# EAGLE design IG01 (EAGLE 6.3)
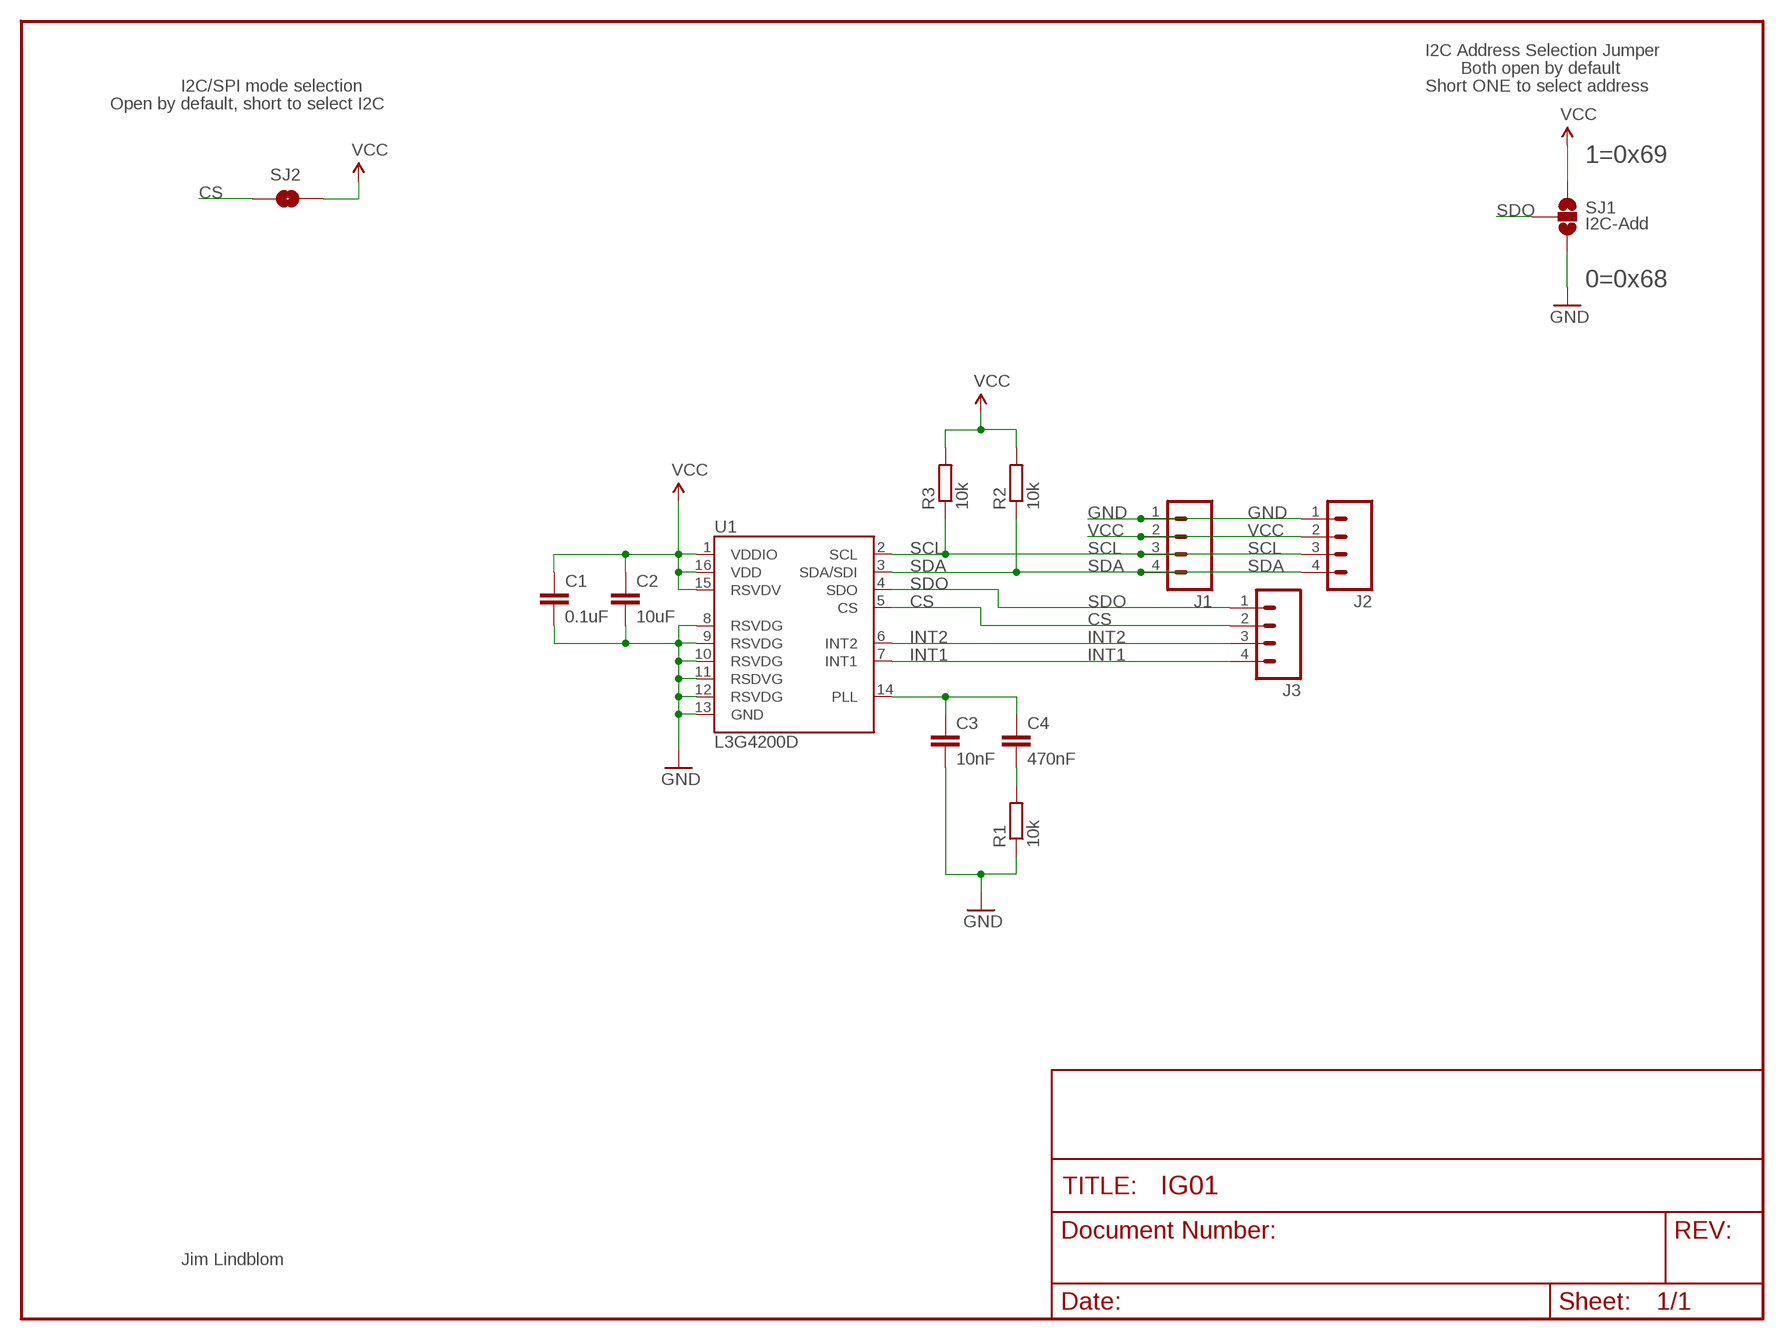
[diagram p0: schematic, sheet 1]

## Parts
C1  0.1uF  C-EUC0805  [C0805]
C2  10uF  C-EUC1206  [C1206]
C3  10nF  C-EUC0805  [C0805]
C4  470nF  C-EUC0805  [C0805]
J1  M04PTH  [1X04]
J2  M04PTH  [1X04]
J3  M04PTH  [1X04]
R1  10k  R-EU_M0805  [M0805]
R2  10k  R-EU_M0805  [M0805]
R3  10k  R-EU_M0805  [M0805]
SJ1  I2C-Add  SOLDERJUMPER_2WAYS  [SJ_3]
SJ2  I2C-Mode  SOLDERJUMPERNO  [SJ_2S-NO]
U1  L3G4200D  [LGA16-4X4]

## Nets
CS: J3.2 SJ2.1 U1.5(CS)
GND: C1.2 C2.2 C3.2 J1.1 J2.1 R1.1 SJ1.3 U1.8(RSVDG) U1.9(RSVDG) U1.10(RSVDG) U1.11(RSDVG) U1.12(RSVDG) U1.13(GND)
INT1: J3.4 U1.7(INT1)
INT2: J3.3 U1.6(INT2)
PLL: C3.1 C4.1 U1.14(PLL)
PLL-2: C4.2 R1.2
SCL: J1.3 J2.3 R3.1 U1.2(SCL)
SDA: J1.4 J2.4 R2.1 U1.3(SDA/SDI)
SDO: J3.1 SJ1.2 U1.4(SDO)
VCC: C1.1 C2.1 J1.2 J2.2 R2.2 R3.2 SJ1.1 SJ2.2 U1.1(VDDIO) U1.15(RSVDV) U1.16(VDD)

## Notes on the sheet
- I2C Address Selection Jumper
- Both open by default
- I2C/SPI mode selection | Short ONE to select address
- Open by default, short to select I2C
- 1=0x69
- 0=0x68
- Jim Lindblom

## Library data of the parts
C1-C4 = rcl:C-EU: CAPACITOR, European symbol
J1-J3 = SparkFun:M04: Header 4 Standard 4-pin 0.1" header. Use with straight break away headers (SKU : PRT-00116), right angle break away headers (PRT-00553), swiss pins (PRT-00743), machine pins (PRT-00117), and female headers (PRT-00115). Molex polarized connector foot print use with SKU : PRT-08231 with associated crimp pins and housings. 1MM SMD Version SKU: PRT-10208
R1-R3 = rcl:R-EU_: RESISTOR, European symbol
SJ1 = SparkFun:SOLDERJUMPER_2WAY: Solder Jumper 2 way solder jumper
SJ2 = SparkFun:SOLDERJUMPER: Solder Jumper Standard SMD solder jumper. Used to automate production. Two varients : Normally Open and Normally Closed are the same, but have different paste layers. NC will have a large amount of paste and should jumper during reflow.
U1 = SparkFun:L3G4200D: L3G4200D Three-axis, digital output gyroscope The L3G4200D is a low-power three-axis angular rate sensor, has a full scale of ±250/±500/±2000 dps and is capable of measuring rates with a user-selectable bandwidth. It includes a sensing element and an IC interface capable of providing the measured angular rate to the external world through a digital interface (I2C/SPI). Package: 4x4x1.1 LGA-16 (LGA16-4x4.PAC)

## Board
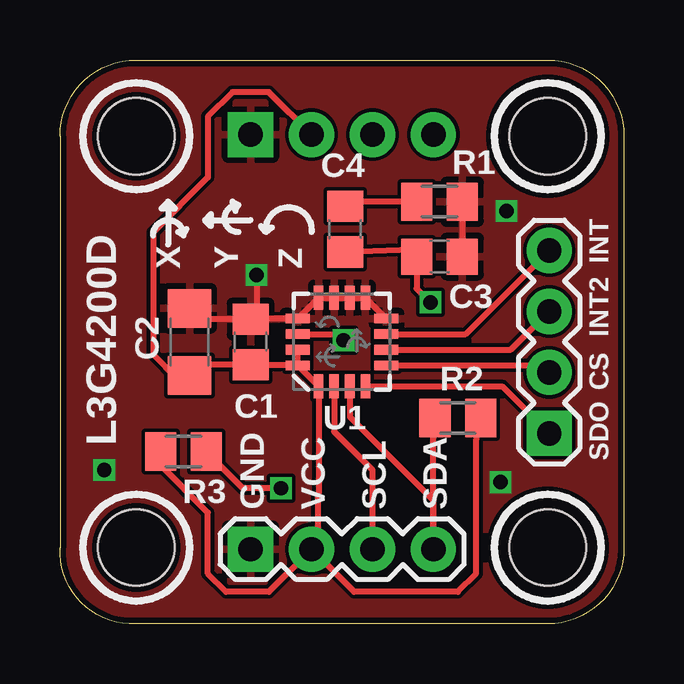
[diagram p1: board, top side]
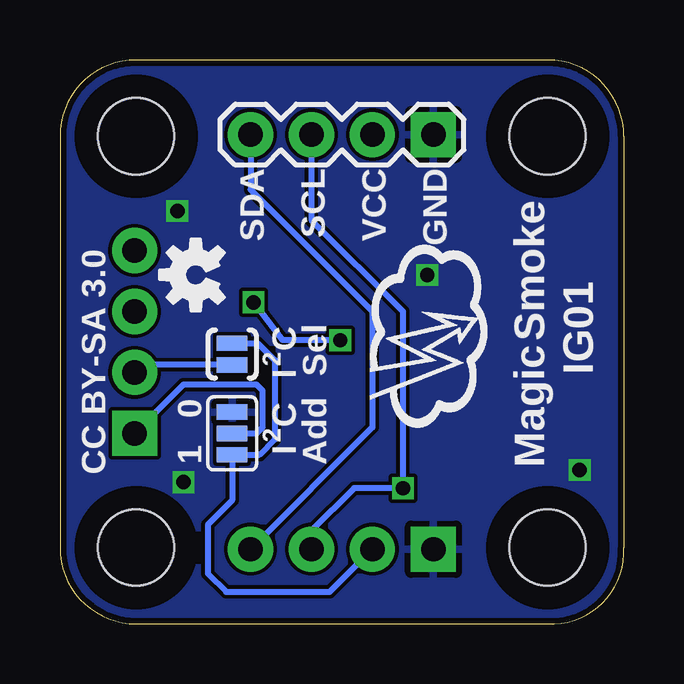
[diagram p2: board, bottom side, seen from below]

Size 23.5 x 23.5 mm. Coordinates in mm from the lower left corner, seen from the top.
Outline: 20.32,23.5 arc-90 23.5,20.32 23.5,3.18 arc-90 20.32,0 3.18,0 arc-96 0,3.18 0,20.32 arc-90 3.18,23.5 20.32,23.5
Copper layers (1*2*15*16): Top 0.035mm / dielectric 0.2mm / Route2 0.0175mm / dielectric 1.1mm / Route15 0.0175mm / dielectric 0.2mm / Bottom 0.035mm
Design rules "SeeedStudio_DRU_no_angle_20130527": minimum track width 6mil, minimum drill 12mil, track to track 6mil, track to pad 6mil, pad to pad 6mil, via to via 6mil, smd to smd 0mil, copper to edge 10mil, drill to drill 10mil, minimum pad ring 6mil, minimum via ring 6mil, stop-mask expansion 2mil, vias tented up to drill 25mil, thermal gap 10mil
Holes 3.17 mm at 20.32,3.18 20.32,20.32 3.18,3.18 3.18,20.32
tRestrict: area 17.8,17.8 to 22.9,22.9; area 17.8,0.6 to 22.9,5.7
bRestrict: area 17.8,17.8 to 22.9,22.9; area 17.8,0.6 to 22.9,5.7; area 0.6,0.6 to 5.7,5.7; area 0.6,17.8 to 5.7,22.9

### Footprints (pad centres in the part's own frame; a part is rotated, then mirrored left to right if it is on the bottom)
C0805 = smd 1.3 x 1.5: 1 -0.95,0; 2 0.95,0
C1206 = smd 1.6 x 1.8: 1 -1.4,0; 2 1.4,0
1X04 = drill 1.016 pad 1.88 square: 1 0,0 | drill 1.016 pad 1.88: 2 2.54,0; 3 5.08,0; 4 7.62,0
M0805 = smd 1.3 x 1.6: 1 -0.95,0; 2 0.95,0
SJ_3 = smd 0.635 x 1.27: 1 -0.889,0; 2 0,0; 3 0.889,0
SJ_2S-NO = smd 0.635 x 1.27: 1 -0.45,0; 2 0.45,0
LGA16-4X4 = smd 1 x 0.4: 1 -1.85,0.975; 2 -1.85,0.325; 3 -1.85,-0.325; 4 -1.85,-0.975; 9 1.85,-0.975; 10 1.85,-0.325; 11 1.85,0.325; 12 1.85,0.975 | smd 0.4 x 1: 5 -0.975,-1.85; 6 -0.325,-1.85; 7 0.325,-1.85; 8 0.975,-1.85; 13 0.975,1.85; 14 0.325,1.85; 15 -0.325,1.85; 16 -0.975,1.85

### Placement (x,y rotation side)
C1  7.94,11.75 90 top
C2  5.4,11.75 90 top
C3  15.81,15.31 0 top
C4  11.88,16.45 90 top
J1  7.94,3.11 0 top
J2  7.94,20.39 180 bottom
J3  20.39,7.94 90 top
R1  15.81,17.59 180 top
R2  16.58,8.57 0 top
R3  5.15,7.18 180 top
SJ1  16.32,7.94 90 bottom
SJ2  16.32,11.24 90 bottom
U1  11.75,11.75 90 top
U$3  [OSHW-LOGO-S]  17.85,14.54 90 bottom

### Tracks (layer width: path | path; a pad name or v marks a point on that pad's centre or on a via)
CS
  Top 0.254: U1.5 20.09,10.77 J3.2
  Bottom 0.254: SJ2.1 20.07,10.79 J3.2
GND  (via drill 0.6)
  Top 0.254: U1.8 U1.9 U1.10 U1.11 U1.12 U1.13 7.96,12.72 C1.2 | C1.2 5.85,12.7 C2.2 | R1.1 C3.2 | v8.19,14.54 8.19,13.02 8.45,13.21 C1.2
  other vias: 18.61,17.21 18.35,5.91 1.84,6.42
  pour Bottom: -0.95,-0.95 -0.95,24.45 24.45,24.45 24.45,-0.95
  pour Top: -0.63,24.13 24.13,24.13 24.13,-0.63 -0.63,-0.63
INT1
  Top 0.254: U1.7 16.9,12.07 J3.4
INT2
  Top 0.254: U1.6 18.79,11.42 J3.3
PLL  (via drill 0.6)
  Top 0.254: U1.14 11.57,12.07 11.62,12.13 v11.82,11.82 | C4.1 15.31,15.63 C3.1 14.86,13.97 v15.43,13.4
  Bottom 0.254: v11.82,11.82 14.22,11.82 v15.43,13.4
PLL-2
  Top 0.254: R1.2 12.32,17.59 C4.2
SCL  (via drill 0.6)
  Top 0.254: 5.65,6.92 5.59,6.99 R3.1 7.62,5.65 v9.21,5.65 | U1.2 11.42,8.01 13.02,6.42 J1.3
  Bottom 0.254: J1.3 13.02,3.88 11.24,5.65 v9.21,5.65 9.21,13.02 13.02,16.83 J2.3
SDA
  Top 0.254: U1.3 12.07,8.63 15.56,5.15 J1.4 15.56,7.75 R2.1
  Bottom 0.254: J2.4 15.56,18.1 10.48,13.02 10.48,8.19 J1.4
SDO
  Top 0.254: U1.4 18.43,9.9 J3.1
  Bottom 0.254: SJ1.2 15.31,7.94 15.05,8.19 15.05,9.72 15.31,9.97 18.35,9.97 J3.1
VCC
  Top 0.254: U1.16 U1.1 10.77,5.44 10.73,5.4 10.73,3.37 J1.2 | U1.16 U1.15 | J1.2 12.26,1.34 16.58,1.34 17.34,2.1 17.34,7.62 R2.2 | J1.2 8.7,1.34 6.92,1.34 6.16,2.1 6.16,4.64 4.13,6.67 R3.2 | U1.16 9.87,10.8 C1.1 5.85,10.8 C2.1 5.28,10.23 4.89,10.23 3.88,11.24 3.88,16.32 6.16,18.61 6.16,21.15 7.18,22.16 8.7,22.16 J2.2
  Bottom 0.254: J1.2 12.26,1.34 16.58,1.34 17.34,2.1 17.34,4.13 16.32,5.15 SJ1.1 15.18,7.05 14.54,7.69 14.54,10.99 15.25,11.69 SJ2.2

### Text on the board
tPlace: INT | X | Y | Z | INT2 | CS | SDO | L3G4200D | GND | VCC | SCL | SDA
bPlace: GND | VCC | SCL | SDA | Smoke | IG01 | Sel | Magic | C | I | 2 | Add | C | 0 | I | 2 | 1 | CC BY-SA 3.0